# Altium schematic sheet Comms.SchDoc
size A3
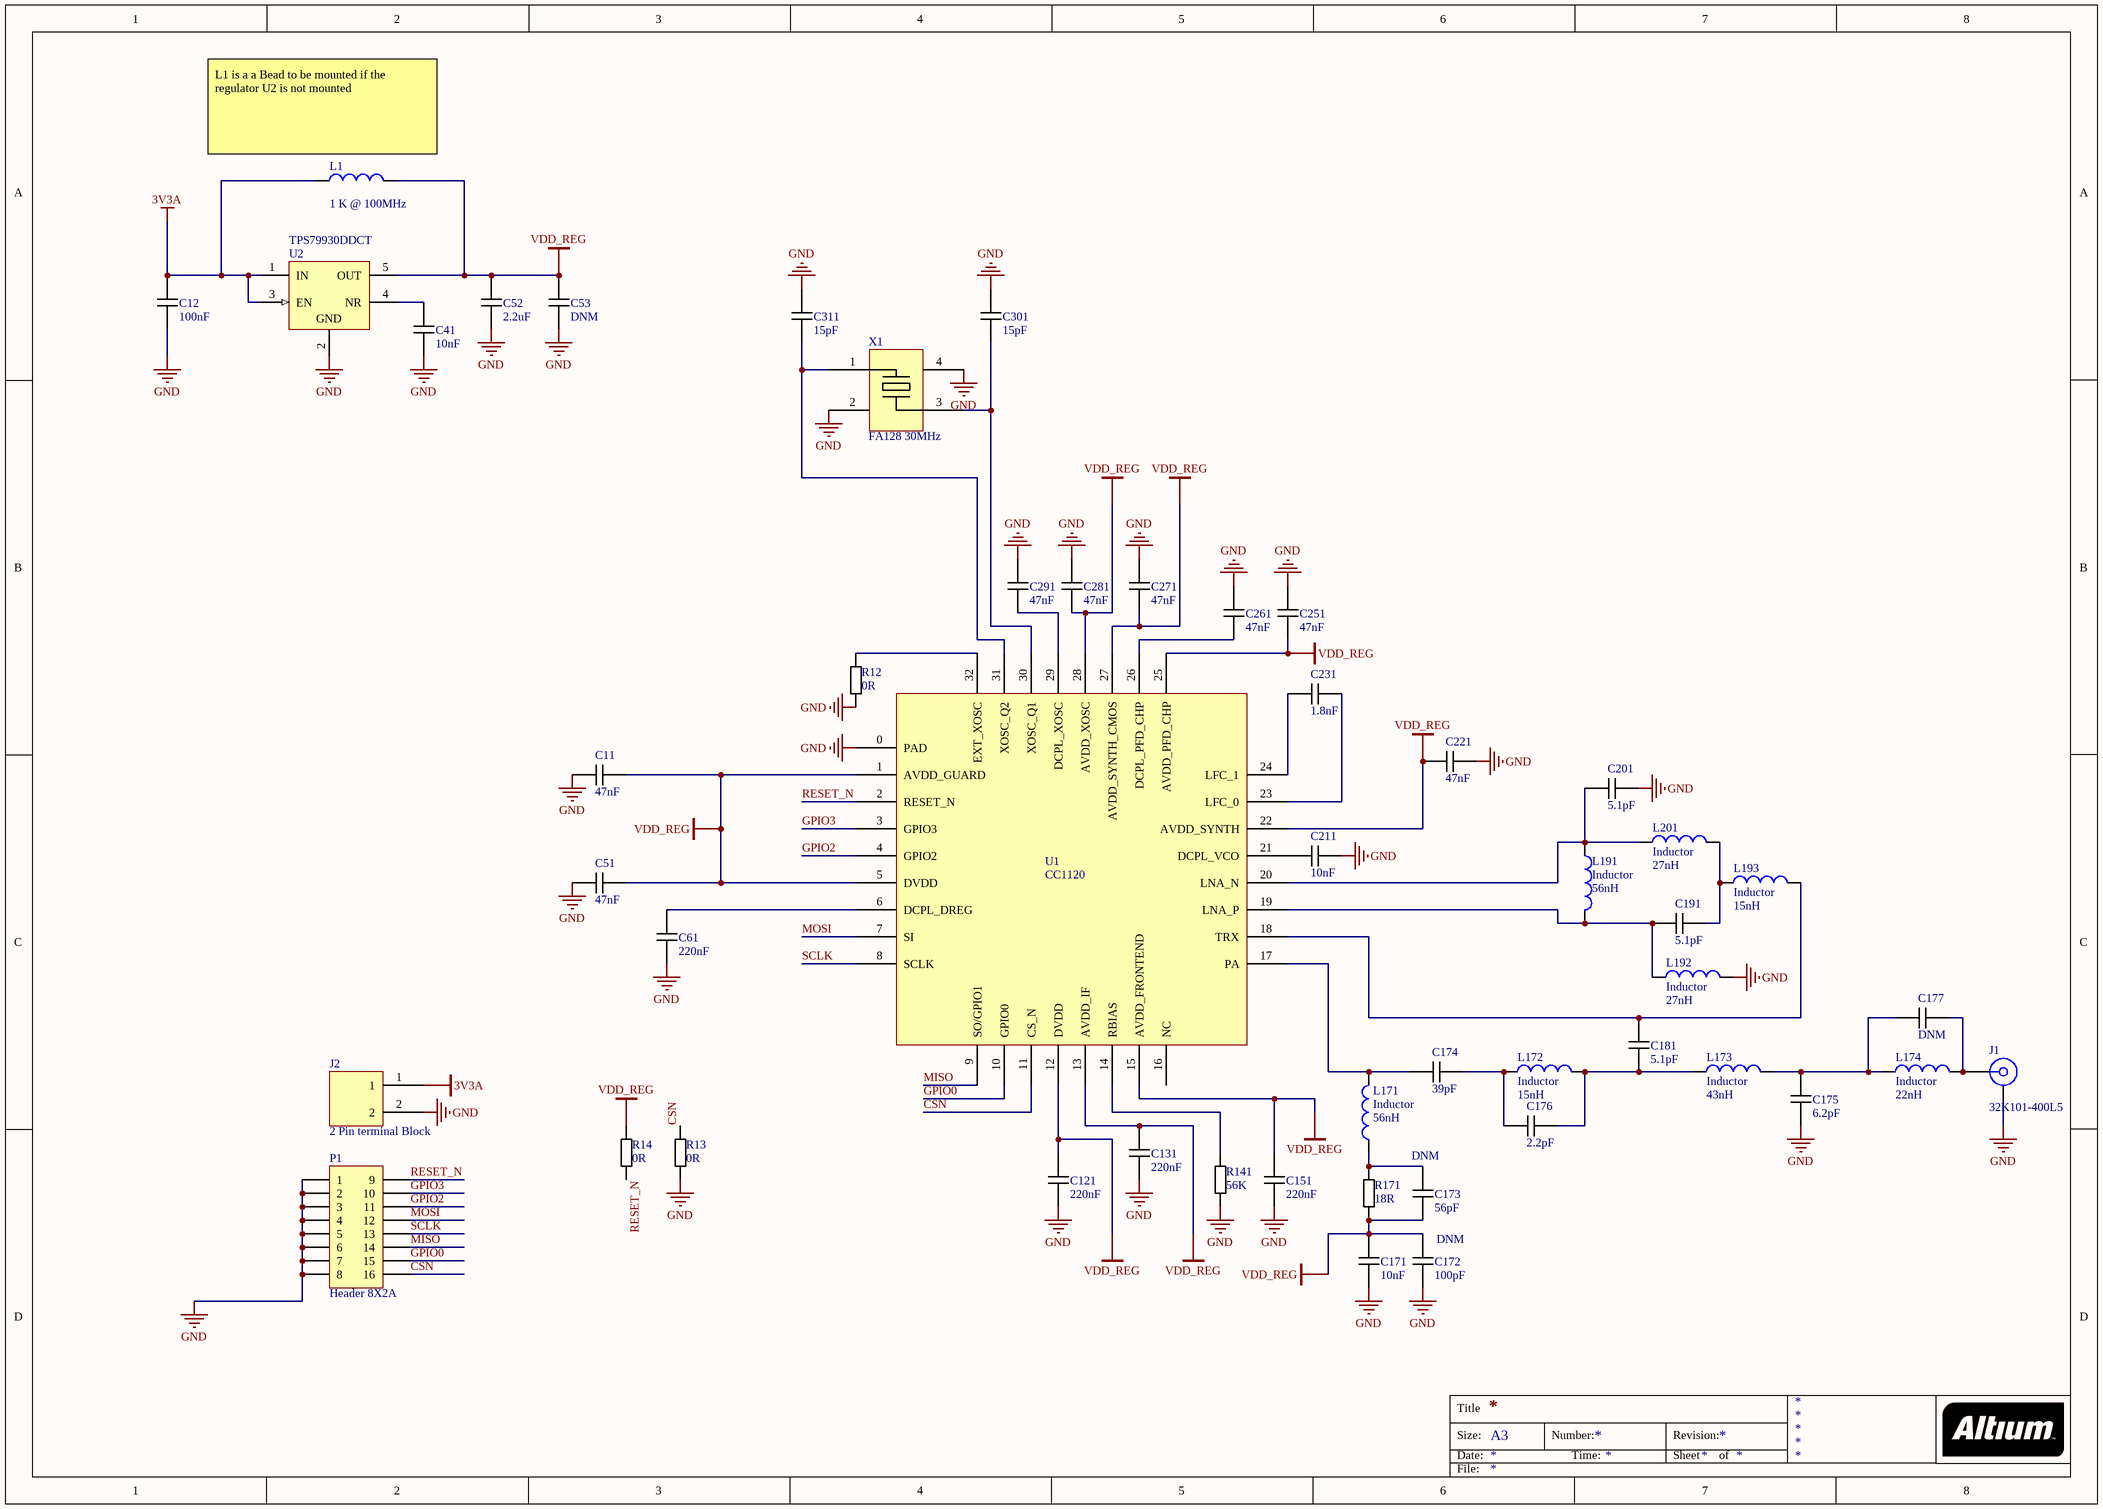
[diagram p0: Comms.SchDoc]

## Parts
C11  value 47nF  [0805 Cap]  (hidden comment: 0805 Cap)
C12  value 100nF  [0805 Cap]  (hidden comment: 0805 Cap)
C41  value 10nF  [0805 Cap]  (hidden comment: 0805 Cap)
C51  value 47nF  [0805 Cap]  (hidden comment: 0805 Cap)
C52  value 2.2uF  [0805 Cap]  (hidden comment: 0805 Cap)
C53  DNM  [0805 Cap]
C61  value 220nF  [0805 Cap]  (hidden comment: 0805 Cap)
C121  value 220nF  [0805 Cap]  (hidden comment: 0805 Cap)
C131  value 220nF  [0805 Cap]  (hidden comment: 0805 Cap)
C151  value 220nF  [0805 Cap]  (hidden comment: 0805 Cap)
C171  value 10nF  [0805 Cap]  (hidden comment: 0805 Cap)
C172  DNM  value 100pF  [0805 Cap]
C173  DNM  value 56pF  [0805 Cap]
C174  value 39pF  [0805 Cap]  (hidden comment: 0805 Cap)
C175  value 6.2pF  [0805 Cap]  (hidden comment: 0805 Cap)
C176  value 2.2pF  [0805 Cap]  (hidden comment: 0805 Cap)
C177  DNM  [0805 Cap]
C181  value 5.1pF  [0805 Cap]  (hidden comment: 0805 Cap)
C191  value 5.1pF  [0805 Cap]  (hidden comment: 0805 Cap)
C201  value 5.1pF  [0805 Cap]  (hidden comment: 0805 Cap)
C211  value 10nF  [0805 Cap]  (hidden comment: 0805 Cap)
C221  value 47nF  [0805 Cap]  (hidden comment: 0805 Cap)
C231  value 1.8nF  [0805 Cap]  (hidden comment: 0805 Cap)
C251  value 47nF  [0805 Cap]  (hidden comment: 0805 Cap)
C261  value 47nF  [0805 Cap]  (hidden comment: 0805 Cap)
C271  value 47nF  [0805 Cap]  (hidden comment: 0805 Cap)
C281  value 47nF  [0805 Cap]  (hidden comment: 0805 Cap)
C291  value 47nF  [0805 Cap]  (hidden comment: 0805 Cap)
C301  value 15pF  [0805 Cap]  (hidden comment: 0805 Cap)
C311  value 15pF  [0805 Cap]  (hidden comment: 0805 Cap)
J1  32K101-400L5  [ROS-32K101-400L5_V]
J2  2 Pin terminal Block  [5.05mm Terminal Block - 2]
L1  value 1 K @ 100MHz  [0805 Resistor]
L171  Inductor  value 56nH  [0805 Resistor]
L172  Inductor  value 15nH  [0805 Resistor]
L173  Inductor  value 43nH  [0805 Resistor]
L174  Inductor  value 22nH  [0805 Resistor]
L191  Inductor  value 56nH  [0805 Resistor]
L192  Inductor  value 27nH  [0805 Resistor]
L193  Inductor  value 15nH  [0805 Resistor]
L201  Inductor  value 27nH  [0805 Resistor]
P1  Header 8X2A  [HDR2X8_CEN]
R12  value 0R  [0805 Resistor]  (hidden comment: 0805 Resistor)
R13  value 0R  [0805 Resistor]  (hidden comment: 0805 Resistor)
R14  value 0R  [0805 Resistor]  (hidden comment: 0805 Resistor)
R141  value 56K  [0805 Resistor]  (hidden comment: 0805 Resistor)
R171  value 18R  [0805 Resistor]  (hidden comment: 0805 Resistor)
U1  CC1120  [TI-RHB]
U2  TPS79930DDCT  [TI-DDC5_N]
X1  FA128 30MHz  [FA128]

## Nets
3V3A: C12.2 J2.1 L1.1 U2.1(IN) U2.3(EN)
GND: C11.2 C12.1 C41.1 C51.2 C52.1 C53.2 C61.2 C121.1 C131.1 C151.1 C171.1 C172.1 C175.2 C201.2 C211.2 C221.2 C251.2 C261.2 C271.2 C281.2 C291.2 C301.2 C311.2 J1.MH J2.2 L192.2 P1.1 P1.2 P1.3 P1.4 P1.5 P1.6 P1.7 P1.8 R12.1 R13.1 R141.2 U1.0(PAD) U2.2(GND) X1.2 X1.4
VDD_REG: C11.1 C51.1 C52.2 C53.1 C121.2 C131.2 C151.2 C171.2 C172.2 C173.1 C221.1 C251.1 C271.1 C281.1 L1.2 R14.1 R171.1 U1.1(AVDD_GUARD) U1.5(DVDD) U1.12(DVDD) U1.13(AVDD_IF) U1.15(AVDD_FRONTEND) U1.22(AVDD_SYNTH) U1.25(AVDD_PFD_CHP) U1.27(AVDD_SYNTH_CMOS) U1.28(AVDD_XOSC) U2.5(OUT)
CSN: P1.16 R13.2 U1.11(CS_N)
GPIO0: P1.15 U1.10(GPIO0)
GPIO2: P1.11 U1.4(GPIO2)
GPIO3: P1.10 U1.3(GPIO3)
MISO: P1.14 U1.9(SO/GPIO1)
MOSI: P1.12 U1.7(SI)
RESET_N: P1.9 R14.2 U1.2(RESET_N)
SCLK: P1.13 U1.8(SCLK)
NetC41_2: C41.2 U2.4(NR)
NetC61_1: C61.1 U1.6(DCPL_DREG)
NetC173_2: C173.2 L171.1 R171.2
NetC174_1: C174.1 C176.1 L172.1
NetC174_2: C174.2 L171.2 U1.17(PA)
NetC175_1: C175.1 C177.2 L173.2 L174.1
NetC176_2: C176.2 C181.1 L172.2 L173.1
NetC177_1: C177.1 J1.1 L174.2
NetC181_2: C181.2 L193.2 U1.18(TRX)
NetC191_1: C191.1 L191.2 L192.1 U1.19(LNA_P)
NetC191_2: C191.2 L193.1 L201.2
NetC201_1: C201.1 L191.1 L201.1 U1.20(LNA_N)
NetC211_1: C211.1 U1.21(DCPL_VCO)
NetC231_1: C231.1 U1.24(LFC_1)
NetC231_2: C231.2 U1.23(LFC_0)
NetC261_1: C261.1 U1.26(DCPL_PFD_CHP)
NetC291_1: C291.1 U1.29(DCPL_XOSC)
NetC301_1: C301.1 U1.30(XOSC_Q1) X1.3
NetC311_1: C311.1 U1.31(XOSC_Q2) X1.1
NetR12_2: R12.2 U1.32(EXT_XOSC)
NetR141_1: R141.1 U1.14(RBIAS)

Not connected (* = marked no-connect by the designer): U1 16(NC)

## Notes on the sheet
- (near L1) L1 is a a Bead to be mounted if the regulator U2 is not mounted
- Title
- Size:
- Date:
- A3
- Number:
- Time:
- Revision:
- Sheet
- of
- File:

## Library data of the parts
C11 C51 C53 C61 C121 C131 C151 C177 = 0805 MLCC - X7R, 10%: Manufacturer: Kit; Supplier: Digikey; Supplier P/N: C2012X7R1H104K085AA; Manufacturer P/N: Kit
C12 C41 C52 C171-C176 C181 C191 C201 C301 C311 = 0805 MLCC - NP0, 5%
C211 C221 C251 C261 C271 C281 C291 = 0805 MLCC - X7R, 10%
C231 = 0805 MLCC - NP0, 5%: 0805 MLCC - U2J, 5%
J1 = 32K101-400L5: SMA Straight Jack, Up to 18 GHz, -55 to 155 degC; Design Note: Footprint in library is a generic example - only application specific footprint delivers High Performance; DatasheetVersion: a00; PackageVersion: a00; PackageReference: 32K101-400L5; PackageDescription: SMA Straight Jack, 6.35 x 6.35 x 9.5 mm; Mounting Technology: Through Hole; PartNumber: 32K101-400L5; ComponentLink1Description: Manufacturer URL; ComponentLink1URL: http://www.rosenberger.de; ComponentLink2Description: Datasheet; ComponentLink2URL: http://rosenberger.de/ok/images/documents/db/32K101-400L5.pdf; ComponentLink3Description: Package Specification; ComponentLink3URL: http://rosenberger.de/ok/images/documents/db/32K101-400L5.pdf; ComponentLink4Description: Series Overview / Design Note; ComponentLink4URL: http://rosenberger.de/ok/images/documents/spez/32.pdf; ComponentLink5Description: Webshop / RFQ; ComponentLink5URL: http://www.rosenberger.com/en/contact/sales/
J2 = 2 Terminal Block
L1 = Inductor: digikey: 490-1041-1-ND; Code_IEC: 1005; Published: 8-Jun-2000; LatestRevisionDate: 29-May-2009; LatestRevisionNote: IPC-7351 Footprint Added.; PackageReference: 0402-A; Publisher: Altium Limited; PackageDescription: Chip Inductor; Code_JEITA: 0402
L171-L174 L191-L193 L201 = Inductor: Code_IEC: 1005; Published: 8-Jun-2000; LatestRevisionDate: 29-May-2009; LatestRevisionNote: IPC-7351 Footprint Added.; PackageReference: 0402-A; Publisher: Altium Limited; PackageDescription: Chip Inductor; Code_JEITA: 0402
P1 = Header 8X2A: Header, 8-Pin, Dual row; LatestRevisionDate: 17-Jul-2002; LatestRevisionNote: Re-released for DXP Platform.; Publisher: Altium Limited
R12-R14 R171 = 0805 Thick Film Resistor 1%
R141 = 0805 Thick Film Resistor 1%: Manufacturer: Stackpole Electronics; Manufacturer P/N: RMCF0805FT10K0; Supplier: Digikey; Supplier P/N: RMCF0805FT10K0CT-ND
U1 = CC1120: Digi-Key Part Number 296-35667-1-ND
U2 = TPS79930DDCT: Single Output High PSRR LDO, 200 mA, Fixed 3 V Output, 2.7 to 6.5 V Input, with Low IQ, 5-pin SOT (DDC), -40 to 85 degC, Green (RoHS & no Sb/Br); Manufacturer: Texas Instruments; Accuracy(%): 2; Fixed Output Options(V): 3.1; Iout(Max)(A): 0.2; Iq(Typ)(mA): 0.04; Rating: Catalog; SubFamily: Single Channel LDO; Vdo(Typ)(mV): 100; Vin(Max)(V): 6.5; Vin(Min)(V): 2.7; Vout Adj(Max)(V): 3; DatasheetVersion: SBVS056J; PackageVersion: 4204403-2/E; PackageReference: DDC5; PackageDescription: 5-Pin Plastic Small Outline, Body 2.9 x 1.6 mm, 0.95 mm Pitch; Supplier 1: Digi-Key; Supplier Part Number 1: 296-17782-2-ND; Supplier 2: Digi-Key; Supplier Part Number 2: 296-17782-1-ND; Supplier 3: Digi-Key; Supplier Part Number 3: 296-17782-6-ND; Supplier 4: Farnell; Supplier Part Number 4: 1135402; Supplier 5: Farnell; Supplier Part Number 5: 1135402RL; Supplier 6: Newark; Supplier Part Number 6: 08K4990; Supplier 7: Mouser; Supplier Part Number 7: 595-TPS79930DDCT; Eco-Plan: Green (RoHS & no Sb/Br); Vout Adj(Min)(V): 3; Mounting Technology: Surface Mount; Code_JEDEC: MO-193; PartNumber: TPS79930DDCT; ComponentLink1Description: Manufacturer URL; ComponentLink1URL: http://www.ti.com/; ComponentLink2Description: Datasheet; ComponentLink2URL: http://www.ti.com/general/docs/lit/getliterature.tsp?genericPartNumber=TPS79930&fileType=pdf; ComponentLink3Description: Package Specification; ComponentLink3URL: http://www.ti.com/litv/pdf/mpds123d
X1 = 4-Pin Oscillator